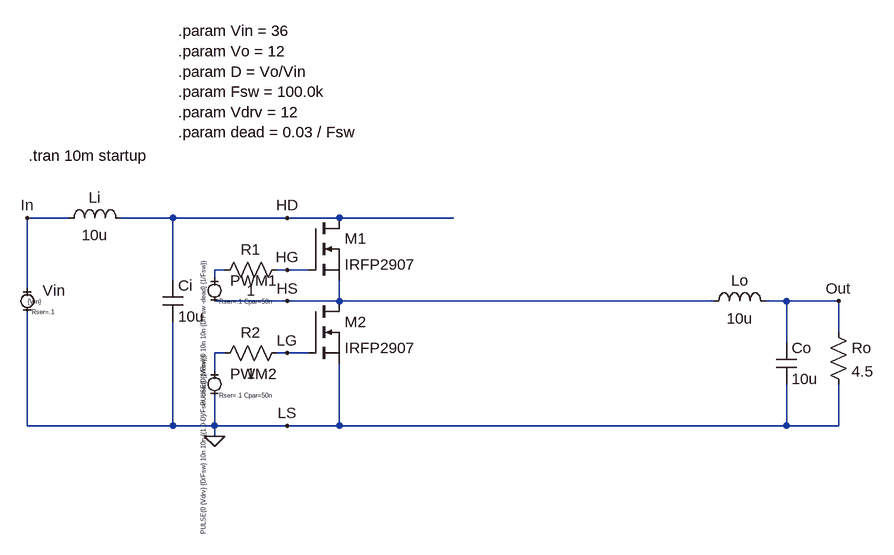
[diagram p0: schematic driver_deadtime_30W.asc]
driver_deadtime_30W.asc, the LTspice schematic file:
Version 4
SHEET 1 1576 680
WIRE 336 80 272 80
WIRE 496 80 416 80
WIRE 672 80 496 80
WIRE 752 80 672 80
WIRE 928 80 752 80
WIRE 576 160 560 160
WIRE 672 160 656 160
WIRE 704 160 672 160
WIRE 496 176 496 80
WIRE 560 176 560 160
WIRE 272 192 272 80
WIRE 672 208 560 208
WIRE 752 208 752 176
WIRE 752 208 672 208
WIRE 1328 208 752 208
WIRE 1440 208 1408 208
WIRE 1520 208 1440 208
WIRE 1520 256 1520 208
WIRE 1440 272 1440 208
WIRE 576 288 560 288
WIRE 672 288 656 288
WIRE 704 288 672 288
WIRE 560 320 560 288
WIRE 272 400 272 224
WIRE 496 400 496 240
WIRE 496 400 272 400
WIRE 560 400 560 352
WIRE 560 400 496 400
WIRE 672 400 560 400
WIRE 752 400 752 304
WIRE 752 400 672 400
WIRE 1440 400 1440 336
WIRE 1440 400 752 400
WIRE 1520 400 1520 336
WIRE 1520 400 1440 400
WIRE 560 416 560 400
FLAG 560 416 0
FLAG 672 400 LS
FLAG 672 288 LG
FLAG 672 160 HG
FLAG 672 80 HD
FLAG 672 208 HS
FLAG 1520 208 Out
FLAG 272 80 In
SYMBOL MiniSyms4\\voltage- 560 192 R0
WINDOW 3 -17 -49 VRight 0
WINDOW 123 0 0 Left 0
WINDOW 39 7 17 Left 0
SYMATTR Value PULSE(0 {Vdrv} 0 10n 10n {D/Fsw -dead} {1/Fsw})
SYMATTR SpiceLine Rser=.1 Cpar=50n
SYMATTR InstName PWM1
SYMBOL MiniSyms4\\voltage- 560 336 R0
WINDOW 3 -17 -49 VRight 0
WINDOW 123 0 0 Left 0
WINDOW 39 7 17 Left 0
SYMATTR Value PULSE(0 {Vdrv} {D/Fsw} 10n 10n {(1.0-D)/Fsw -dead} {1/Fsw})
SYMATTR SpiceLine Rser=.1 Cpar=50n
SYMATTR InstName PWM2
SYMBOL nmos 704 80 R0
SYMATTR InstName M1
SYMATTR Value IRFP2907
SYMBOL nmos 704 208 R0
SYMATTR InstName M2
SYMATTR Value IRFP2907
SYMBOL res 1504 240 R0
SYMATTR InstName Ro
SYMATTR Value 4.5
SYMBOL MiniSyms4\\voltage- 272 208 R0
WINDOW 3 22 1 Right 0
WINDOW 123 0 0 Left 0
WINDOW 39 7 17 Left 0
SYMATTR Value {Vin}
SYMATTR SpiceLine Rser=.1
SYMATTR InstName Vin
SYMBOL res 672 144 R90
WINDOW 0 0 56 VBottom 2
WINDOW 3 32 56 VTop 2
SYMATTR InstName R1
SYMATTR Value 1
SYMBOL res 672 272 R90
WINDOW 0 0 56 VBottom 2
WINDOW 3 32 56 VTop 2
SYMATTR InstName R2
SYMATTR Value 1
SYMBOL cap 480 176 R0
SYMATTR InstName Ci
SYMATTR Value 10u
SYMBOL cap 1424 272 R0
SYMATTR InstName Co
SYMATTR Value 10u
SYMBOL ind 1312 224 R270
WINDOW 0 32 56 VTop 2
WINDOW 3 5 56 VBottom 2
SYMATTR InstName Lo
SYMATTR Value 10u
SYMBOL ind 320 96 R270
WINDOW 0 32 56 VTop 2
WINDOW 3 5 56 VBottom 2
SYMATTR InstName Li
SYMATTR Value 10u
TEXT 504 -208 Left 2 !.param Vin = 36\n.param Vo = 12\n.param D = Vo/Vin\n.param Fsw = 100.0k\n.param Vdrv = 12\n.param dead = 0.03 / Fsw
TEXT 274 -16 Left 2 !.tran 10m startup

The netlist it stands for:
* driver_deadtime_30W.asc
V§PWM1 N001 HS PULSE(0 {Vdrv} 0 10n 10n {D/Fsw -dead} {1/Fsw}) Rser=.1 Cpar=50n
V§PWM2 N002 0 PULSE(0 {Vdrv} {D/Fsw} 10n 10n {(1.0-D)/Fsw -dead} {1/Fsw}) Rser=.1 Cpar=50n
M1 HD HG HS HS IRFP2907
M2 HS LG 0 0 IRFP2907
Ro Out 0 4.5
Vin In 0 {Vin} Rser=.1
R1 HG N001 1
R2 LG N002 1
Ci HD 0 10u
Co Out 0 10u
Lo HS Out 10u
Li In HD 10u
.model NMOS NMOS
.model PMOS PMOS
.lib standard.mos
.param Vin = 36
.param Vo = 12
.param D = Vo/Vin
.param Fsw = 100.0k
.param Vdrv = 12
.param dead = 0.03 / Fsw
.tran 10m startup
.backanno
.end